# Altium schematic sheet BQ76952_monitor.SchDoc
size A4; SheetNumber: 1; SheetTotal: 2
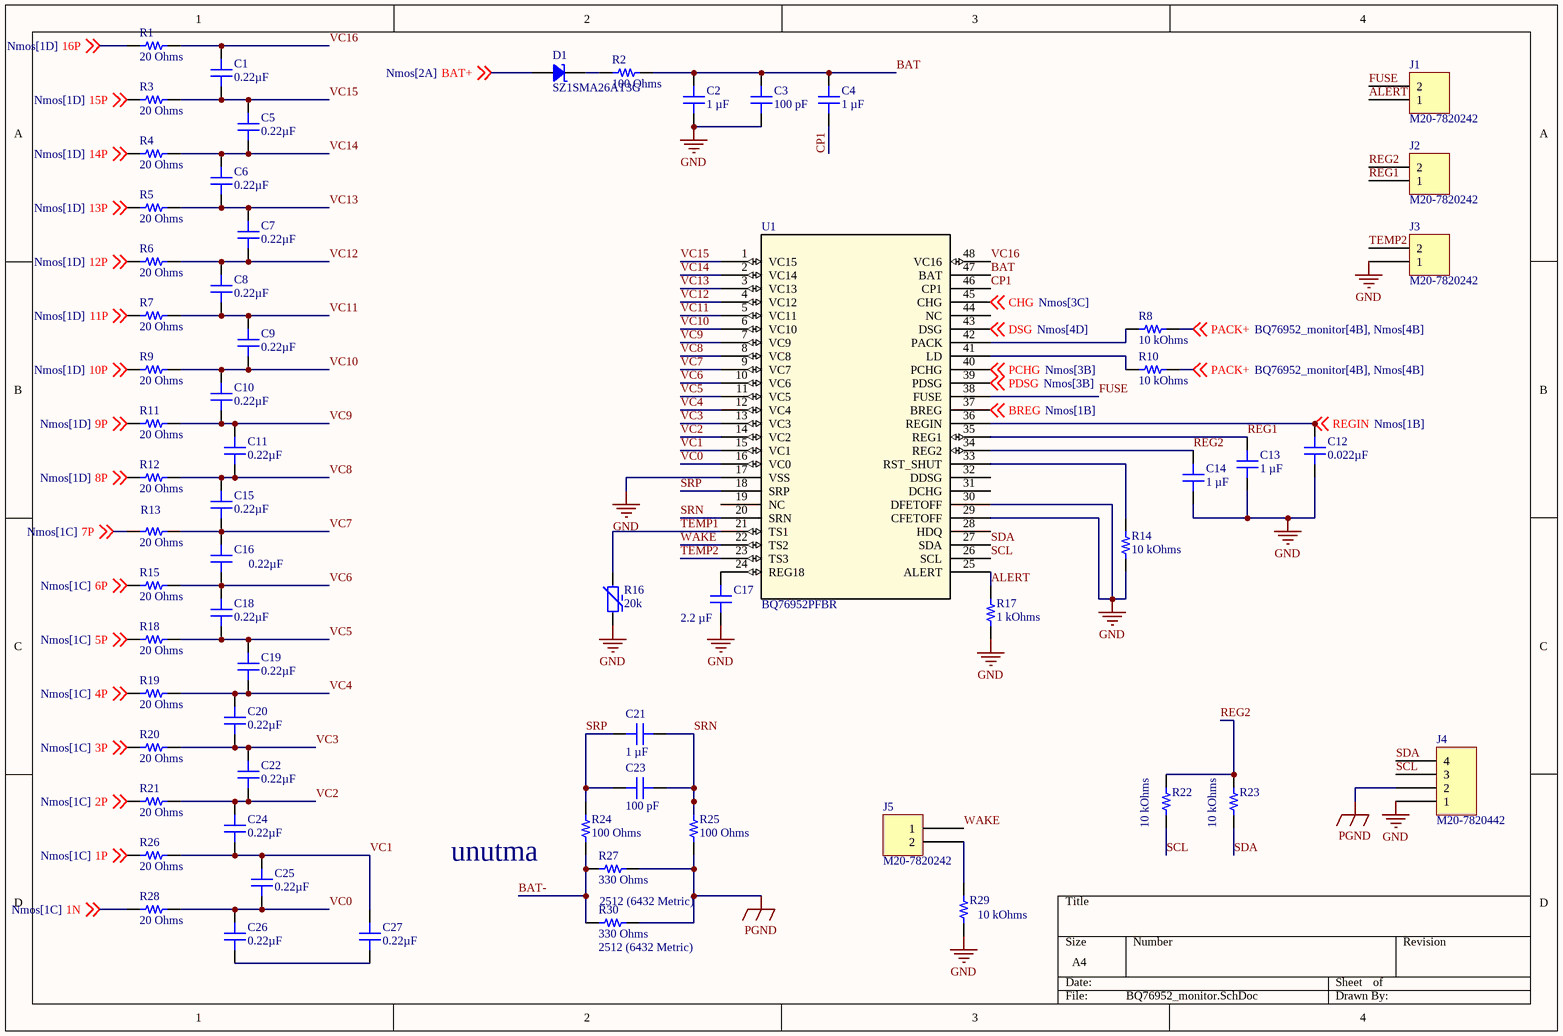
[diagram p0: BQ76952_monitor.SchDoc]

## Parts
C1  0.22µF  [CAP 0805_2012]
C2  1 µF  [CAP 0805_2012]
C3  100 pF  [CAP 0805_2012]
C4  1 µF  [CAP 0805_2012]
C5  0.22µF  [CAP 0805_2012]
C6  0.22µF  [CAP 0805_2012]
C7  0.22µF  [CAP 0805_2012]
C8  0.22µF  [CAP 0805_2012]
C9  0.22µF  [CAP 0805_2012]
C10  0.22µF  [CAP 0805_2012]
C11  0.22µF  [CAP 0805_2012]
C12  0.022µF  [CAP 0805_2012]
C13  1 µF  [CAP 0805_2012]
C14  1 µF  [CAP 0805_2012]
C15  0.22µF  [CAP 0805_2012]
C16  0.22µF  [CAP 0805_2012]
C17  Capacitance: 2.2 µF  [MURATA CAP GRM31M 1206_3216]  (hidden comment: GRM31MR71E225KA93L)
C18  0.22µF  [CAP 0805_2012]
C19  0.22µF  [CAP 0805_2012]
C20  0.22µF  [CAP 0805_2012]
C21  1 µF  [CAP 0805_2012]
C22  0.22µF  [CAP 0805_2012]
C23  100 pF  [CAP 0805_2012]
C24  0.22µF  [CAP 0805_2012]
C25  0.22µF  [CAP 0805_2012]
C26  0.22µF  [CAP 0805_2012]
C27  0.22µF  [CAP 0805_2012]
D1  SZ1SMA26AT3G  [DO214AC SMA]
J1  M20-7820242  [HARWIN M20-7820245]
J2  M20-7820242  [HARWIN M20-7820245]
J3  M20-7820242  [HARWIN M20-7820245]
J4  M20-7820442  [HARWIN M20-7820445]
J5  M20-7820242  [HARWIN M20-7820245]
R1  20 Ohms  [RES 1206_3216]
R2  100 Ohms  [RES 1206_3216]
R3  20 Ohms  [RES 1206_3216]
R4  20 Ohms  [RES 1206_3216]
R5  20 Ohms  [RES 1206_3216]
R6  20 Ohms  [RES 1206_3216]
R7  20 Ohms  [RES 1206_3216]
R8  10 kOhms  [RES 1206_3216]
R9  20 Ohms  [RES 1206_3216]
R10  10 kOhms  [RES 1206_3216]
R11  20 Ohms  [RES 1206_3216]
R12  20 Ohms  [RES 1206_3216]
R13  20 Ohms  [RES 1206_3216]
R14  10 kOhms  [RES 1206_3216]
R15  20 Ohms  [RES 1206_3216]
R16  20k  [NTC 0805_2012]
R17  1 kOhms  [RES 1206_3216]
R18  20 Ohms  [RES 1206_3216]
R19  20 Ohms  [RES 1206_3216]
R20  20 Ohms  [RES 1206_3216]
R21  20 Ohms  [RES 1206_3216]
R22  10 kOhms  [RES 1206_3216]
R23  10 kOhms  [RES 1206_3216]
R24  100 Ohms  [RES 1206_3216]
R25  100 Ohms  [RES 1206_3216]
R26  20 Ohms  [RES 1206_3216]
R27  330 Ohms  Package / Case: 2512 (6432 Metric)  [STACKPOLE CSR2512]
R28  20 Ohms  [RES 1206_3216]
R29  10 kOhms  [RES 1206_3216]
R30  330 Ohms  Package / Case: 2512 (6432 Metric)  [STACKPOLE CSR2512]
U1  BQ76952PFBR  [QFP_2PFBR_TEX]

## Nets
GND: C2.1 C3.1 C12.1 C13.1 C14.1 C17.1 J3.1 J4.1 R14.2 R16.1 R17.1 R29.1 U1.17(VSS) U1.29(CFETOFF) U1.30(DFETOFF)
PGND: J4.2 R25.1 R27.1 R30.1
1N: R28.1 ; off-sheet 1N
1P: R26.1 ; off-sheet 1P
2P: R21.1 ; off-sheet 2P
3P: R20.1 ; off-sheet 3P
4P: R19.1 ; off-sheet 4P
5P: R18.1 ; off-sheet 5P
6P: R15.1 ; off-sheet 6P
7P: R13.1 ; off-sheet 7P
8P: R12.1 ; off-sheet 8P
9P: R11.1 ; off-sheet 9P
10P: R9.1 ; off-sheet 10P
11P: R7.1 ; off-sheet 11P
12P: R6.1 ; off-sheet 12P
13P: R5.1 ; off-sheet 13P
14P: R4.1 ; off-sheet 14P
15P: R3.1 ; off-sheet 15P
16P: R1.1 ; off-sheet 16P
ALERT: J1.1 R17.2 U1.25(ALERT)
BAT: C2.2 C3.2 C4.2 R2.2 U1.47(BAT)
BAT+: D1.1 ; off-sheet BAT+
BAT-: R24.1 R27.2 R30.2
BREG: U1.37(BREG) ; off-sheet BREG
CHG: U1.45(CHG) ; off-sheet CHG
CP1: C4.1 U1.46(CP1)
DSG: U1.43(DSG) ; off-sheet DSG
FUSE: J1.2 U1.38(FUSE)
PACK+: R8.1 R10.1 ; off-sheet PACK+
PCHG: U1.40(PCHG) ; off-sheet PCHG
PDSG: U1.39(PDSG) ; off-sheet PDSG
REG1: C13.2 J2.1 U1.35(REG1)
REG2: C14.2 J2.2 R22.2 R23.2 U1.34(REG2)
REGIN: C12.2 U1.36(REGIN) ; off-sheet REGIN
SCL: J4.3 R22.1 U1.26(SCL)
SDA: J4.4 R23.1 U1.27(SDA)
SRN: C21.1 C23.1 R25.2 U1.20(SRN)
SRP: C21.2 C23.2 R24.2 U1.18(SRP)
TEMP1: R16.2 U1.21(TS1)
TEMP2: J3.2 U1.23(TS3)
VC0: C25.1 C26.2 R28.2 U1.16(VC0)
VC1: C24.1 C25.2 C27.2 R26.2 U1.15(VC1)
VC2: C22.1 C24.2 R21.2 U1.14(VC2)
VC3: C20.1 C22.2 R20.2 U1.13(VC3)
VC4: C19.1 C20.2 R19.2 U1.12(VC4)
VC5: C18.1 C19.2 R18.2 U1.11(VC5)
VC6: C16.1 C18.2 R15.2 U1.10(VC6)
VC7: C15.1 C16.2 R13.2 U1.9(VC7)
VC8: C11.1 C15.2 R12.2 U1.8(VC8)
VC9: C10.1 C11.2 R11.2 U1.7(VC9)
VC10: C9.1 C10.2 R9.2 U1.6(VC10)
VC11: C8.1 C9.2 R7.2 U1.5(VC11)
VC12: C7.1 C8.2 R6.2 U1.4(VC12)
VC13: C6.1 C7.2 R5.2 U1.3(VC13)
VC14: C5.1 C6.2 R4.2 U1.2(VC14)
VC15: C1.1 C5.2 R3.2 U1.1(VC15)
VC16: C1.2 R1.2 U1.48(VC16)
WAKE: J5.1 U1.22(TS2)
NetC17_2: C17.2 U1.24(REG18)
NetC26_1: C26.1 C27.1
NetD1_2: D1.2 R2.1
NetJ5_2: J5.2 R29.2
NetR8_2: R8.2 U1.42(PACK)
NetR10_2: R10.2 U1.41(LD)
NetR14_1: R14.1 U1.33(RST_SHUT)

Not connected (* = marked no-connect by the designer): U1 19(NC) 28(HDQ) 31(DCHG) 32(DDSG) 44(NC)

## Notes on the sheet
- unutma

## Library data of the parts
C1 C5-C11 C15 C16 C18-C20 C22 C24-C27 = 0805YC224KAT2A: CAP CER 0.22UF 16V X7R 0805; manufacturer: AVX Corporation; Tolerance: ±10%; Part Number: 0805YC224KAT2A; Capacitance: 0.22µF; Applications: General Purpose; componentlink1description: Datasheet; componentlink1url: http://datasheets.avx.com/X7RDielectric.pdf; componentlink2description: DigiKey Link; componentlink2url: http://digikey.com/product-detail/en/avx-corporation/0805YC224KAT2A/478-1400-1-ND/564432; Device Package: 0805 (2012 Metric); lastupdated: 2.09.2020 01:04:22; Lifecycle Status: Active; Minimum Order: 1; Mounting Type: Surface Mount, MLCC; Operating Temperature: -55°C ~ 125°C; Package / Case: 0805 (2012 Metric); packaging: TapeAndReel; partid: 13081; Part Status: Active; price: 0.05; series: -; Size / Dimension: 0.079" L x 0.049" W (2.01mm x 1.25mm); Supplier 1: DigiKey; Supplier Part Number 1: 478-1400-1-ND; Temperature Coefficient: X7R; Thickness (Max): 0.037" (0.94mm); value: 0.22µF; Voltage - Rated: 16V
C2 C4 C21 = HMR212CC7105KG-T: CAP MLCC 1UF 10% 100V X7S 0805; manufacturer: Taiyo Yuden; Part Number: HMR212CC7105KG-T; Capacitance: 1 µF; Applications: Automotive, Bypass, Decoupling; componentlink1description: Datasheet; componentlink1url: https://ds.yuden.co.jp/TYCOMPAS/ut/detail?pn=HMR212CC7105KG-T&u=M; componentlink2description: DigiKey Link; componentlink2url: https://www.digikey.com/en/products/detail/taiyo-yuden/HMR212CC7105KG-T/13414962; Device Package: 0805 (2012 Metric); lastupdated: 9.02.2024 20:14:59; Lifecycle Status: Active; Minimum Order: 1; Mounting Type: Surface Mount, MLCC; Operating Temperature: -55°C ~ 125°C; Package / Case: 0805 (2012 Metric); packaging: TapeAndReel; partid: 42417; Part Status: Active; price: 0.08; Ratings: AEC-Q200; series: M; Size / Dimension: 0.079" L x 0.049" W (2.00mm x 1.25mm); Supplier 1: DigiKey; Supplier Part Number 1: 587-HMR212CC7105KG-TCT-ND; Temperature Coefficient: X7S; Thickness (Max): 0.059" (1.50mm); Tolerance: ±10%; value: 1 µF; Voltage - Rated: 100V
C3 C23 = CL21C101JC61PNC: CAP CER 100PF 100V C0G/NP0 0805; manufacturer: Samsung Electro-Mechanics; Temperature Coefficient: C0G, NP0; Tolerance: ±5%; Part Number: CL21C101JC61PNC; Capacitance: 100 pF; Applications: Automotive; componentlink1description: Datasheet; componentlink1url: http://www.samsungsem.com/kr/support/product-search/mlcc/CL21C101JC61PNC.jsp; componentlink2description: DigiKey Link; componentlink2url: https://www.digikey.com/en/products/detail/samsung-electro-mechanics/CL21C101JC61PNC/3888227; Device Package: 0805 (2012 Metric); lastupdated: 9.02.2024 20:15:36; Lifecycle Status: Active; Minimum Order: 1; Mounting Type: Surface Mount, MLCC; Operating Temperature: -55°C ~ 125°C; Package / Case: 0805 (2012 Metric); packaging: TapeAndReel; partid: 14416; Part Status: Active; price: 0.01; Ratings: AEC-Q200; series: CL; Size / Dimension: 0.079" L x 0.049" W (2.00mm x 1.25mm); Supplier 1: DigiKey; Supplier Part Number 1: 1276-2569-1-ND; Thickness (Max): 0.028" (0.70mm); value: 100 pF; Voltage - Rated: 100V
C12 = 08051C223K4T2A: CAP CER 0.022UF 100V X7R 0805; manufacturer: AVX Corporation; Tolerance: ±10%; Part Number: 08051C223K4T2A; Capacitance: 0.022µF; Applications: Automotive; componentlink1description: Datasheet; componentlink1url: http://datasheets.avx.com/AutoMLCC.pdf; componentlink2description: DigiKey Link; componentlink2url: http://digikey.com/product-detail/en/avx-corporation/08051C223K4T2A/478-9378-1-ND/4901452; Device Package: 0805 (2012 Metric); lastupdated: 2.09.2020 01:04:32; Lifecycle Status: Active; Minimum Order: 1; Mounting Type: Surface Mount, MLCC; Operating Temperature: -55°C ~ 125°C; Package / Case: 0805 (2012 Metric); packaging: TapeAndReel; partid: 7798; Part Status: Active; price: 0.03; Ratings: AEC-Q200; series: -; Size / Dimension: 0.079" L x 0.049" W (2.00mm x 1.25mm); Supplier 1: DigiKey; Supplier Part Number 1: 478-9378-1-ND; Temperature Coefficient: X7R; Thickness (Max): 0.050" (1.27mm); value: 0.022µF; Voltage - Rated: 100V
C13 C14 = C0805C105M4VAC7800: CAP CER 1UF 16V Y5V 0805; manufacturer: KEMET; Temperature Coefficient: Y5V (F); Tolerance: ±20%; Part Number: C0805C105M4VAC7800; Capacitance: 1 µF; Applications: General Purpose; componentlink1description: Datasheet; componentlink1url: https://connect.kemet.com:7667/gateway/IntelliData-ComponentDocumentation/1.0/download/datasheet/C0805C105M4VACTU; componentlink2description: DigiKey Link; componentlink2url: https://www.digikey.com/en/products/detail/kemet/C0805C105M4VAC7800/2211778; Device Package: 0805 (2012 Metric); lastupdated: 9.02.2024 20:15:00; Lifecycle Status: Active; Minimum Order: 1; Mounting Type: Surface Mount, MLCC; Operating Temperature: -30°C ~ 85°C; Package / Case: 0805 (2012 Metric); packaging: TapeAndReel; partid: 42473; Part Status: Active; price: 0.02; series: SMD Comm Y5V; Size / Dimension: 0.079" L x 0.049" W (2.00mm x 1.25mm); Supplier 1: DigiKey; Supplier Part Number 1: 399-C0805C105M4VAC7800CT-ND; Thickness (Max): 0.039" (1.00mm); value: 1 µF; Voltage - Rated: 16V
C17 = GRM31MR71E225KA93L: CAP CER 2.2UF 25V X7R 1206; manufacturer: Murata Electronics; Tolerance: ±10%; Part Number: GRM31MR71E225KA93L; Applications: General Purpose; componentlink1description: Datasheet; componentlink1url: https://www.murata.com/~/media/webrenewal/support/library/catalog/products/capacitor/mlcc/c02e.ashx?la=en-us; componentlink2description: DigiKey Link; componentlink2url: https://www.digikey.com/en/products/detail/murata-electronics/GRM31MR71E225KA93L/702632; Device Package: 1206 (3216 Metric); lastupdated: 25.07.2024 10:41:16; Lifecycle Status: Active; Minimum Order: 1; Mounting Type: Surface Mount, MLCC; Operating Temperature: -55°C ~ 125°C; Package / Case: 1206 (3216 Metric); packaging: TapeAndReel; partid: 57330; Part Status: Not For New Designs; price: 0.06; series: GRM; Size / Dimension: 0.126" L x 0.063" W (3.20mm x 1.60mm); Supplier 1: DigiKey; Supplier Part Number 1: 490-3368-1-ND; Temperature Coefficient: X7R; Thickness (Max): 0.049" (1.25mm); Voltage - Rated: 25V
D1 = SZ1SMA26AT3G: TVS DIODE 26VWM 42.1VC SMA; Manufacturer: Littelfuse Inc.; Capacitance @ Frequency: 460pF @ 1MHz; Current - Peak Pulse (10/1000µs): 9.5A; Power Line Protection: No; Power - Peak Pulse: 400W; Type: Zener; Unidirectional Channels: 1; Voltage - Breakdown (Min): 28.9V; Voltage - Clamping (Max) @ Ipp: 42.1V; Voltage - Reverse Standoff (Typ): 26V; Part Number: SZ1SMA26AT3G; Applications: Automotive; ComponentLink1Description: Datasheet; ComponentLink1URL: https://www.littelfuse.com/~/media/electronics/datasheets/tvs_diodes/littelfuse_tvs_diode_sz1smaxxa_datasheet.pdf.pdf; ComponentLink2Description: DigiKey Link; ComponentLink2URL: https://www.digikey.com/en/products/detail/littelfuse-inc/SZ1SMA26AT3G/3062915; LastUpdated: 3.06.2024 19:57:20; Lifecycle Status: Active; Minimum Order: 1; Mounting Type: Surface Mount; Operating Temperature: -65°C ~ 150°C (TJ); Package / Case: DO-214AC, SMA; Packaging: TapeAndReel; PartId: 5569; Part Status: Active; Price: 0.16; Series: SZ1SMA; Supplier 1: DigiKey; Supplier Part Number 1: F11514CT-ND; Supplier Device Package: SMA
J1-J3 J5 = M20-7820242: CONN RCPT 2POS 0.1 GOLD PCB; Manufacturer: Harwin Inc.; Connector Type: Receptacle; Contact Length - Post: 0.118" (3.00mm); Current Rating (Amps): 3A; Mated Stacking Heights: 11.04mm, 12.63mm; Material Flammability Rating: UL94 V-0; Number of Positions: 2; Number of Positions Loaded: All; Pitch - Mating: 0.100" (2.54mm); Style: Board to Board or Cable; Part Number: M20-7820242; ComponentLink1Description: Datasheet; ComponentLink1URL: https://cdn.harwin.com/pdfs/C001XX_M20_Series_Connectors.pdf; ComponentLink2Description: DigiKey Link; ComponentLink2URL: https://www.digikey.com/en/products/detail/harwin-inc/M20-7820242/3727744; Contact Finish - Mating: Gold; Contact Finish - Post: Tin; Contact Finish Thickness - Mating: Flash; Contact Type: Female Socket; Fastening Type: Push-Pull; Insulation Color: Black; Insulation Height: 0.335" (8.51mm); LastUpdated: 21.09.2022 18:53:47; Lifecycle Status: Active; Minimum Order: 1; Mounting Type: Through Hole; Number of Rows: 1; Operating Temperature: -40°C ~ 105°C; Packaging: Tube; Part Status: Active; Price: 0.38; Series: M20; Supplier 1: DigiKey; Supplier Part Number 1: 952-1775-ND; Termination: Solder
J4 = M20-7820442: CONN RCPT 4POS 0.1 GOLD PCB; Manufacturer: Harwin Inc.; Connector Type: Receptacle; Contact Length - Post: 0.118" (3.00mm); Current Rating (Amps): 3A; Mated Stacking Heights: 11.04mm, 12.63mm; Material Flammability Rating: UL94 V-0; Number of Positions: 4; Number of Positions Loaded: All; Pitch - Mating: 0.100" (2.54mm); Style: Board to Board or Cable; Part Number: M20-7820442; ComponentLink1Description: Datasheet; ComponentLink1URL: https://cdn.harwin.com/pdfs/Harwin_PC_Connectors_M20.pdf; ComponentLink2Description: DigiKey Link; ComponentLink2URL: https://www.digikey.com/en/products/detail/harwin-inc/M20-7820442/3727760; Contact Finish - Mating: Gold; Contact Finish - Post: Tin; Contact Finish Thickness - Mating: Flash; Contact Type: Female Socket; Fastening Type: Push-Pull; Insulation Color: Black; Insulation Height: 0.335" (8.51mm); LastUpdated: 21.09.2022 18:57:11; Lifecycle Status: Active; Minimum Order: 1; Mounting Type: Through Hole; Number of Rows: 1; Operating Temperature: -40°C ~ 105°C; Packaging: Tube; Part Status: Active; Price: 0.45; Series: M20; Supplier 1: DigiKey; Supplier Part Number 1: 952-1791-ND; Termination: Solder
R1 R3-R7 R9 R11-R13 R15 R18-R21 R26 R28 = ESR18EZPF20R0: RES SMD 20 OHM 1% 1/2W 1206; Manufacturer: Rohm Semiconductor; Power (Watts): 0.5W, 1/2W; Temperature Coefficient: ±100ppm/°C; Part Number: ESR18EZPF20R0; ComponentLink1Description: Datasheet; ComponentLink1URL: https://www.rohm.com/datasheet/ESR01MZPF/esr-e; ComponentLink2Description: DigiKey Link; ComponentLink2URL: https://www.digikey.com/en/products/detail/rohm-semiconductor/ESR18EZPF20R0/1983601; Composition: Thick Film; Device Package: 1206 (3216 Metric); Features: Automotive AEC-Q200, Pulse Withstanding; Height - Seated (Max): 0.026" (0.65mm); LastUpdated: 9.02.2024 20:54:45; Lifecycle Status: Active; Minimum Order: 1; Number of Terminations: 2; Operating Temperature: -55°C ~ 155°C; Package / Case: 1206 (3216 Metric); Packaging: TapeAndReel; PartId: 26961; Part Status: Active; Price: 0.02; Ratings: AEC-Q200; Resistance: 20 Ohms; Series: ESR; Size / Dimension: 0.126" L x 0.063" W (3.20mm x 1.60mm); Supplier 1: DigiKey; Supplier Part Number 1: RHM20.0AFCT-ND; Supplier Device Package: 1206; Tolerance: ±1%; Value: 20 Ohms
R2 R24 R25 = RNCS1206BKE100R: RES 100 OHM 0.1% 1/8W 1206; Manufacturer: Stackpole Electronics Inc; Power (Watts): 0.125W, 1/8W; Temperature Coefficient: ±25ppm/°C; Part Number: RNCS1206BKE100R; ComponentLink1Description: Datasheet; ComponentLink1URL: https://www.seielect.com/catalog/sei-rncs_rnch.pdf; ComponentLink2Description: DigiKey Link; ComponentLink2URL: https://www.digikey.com/en/products/detail/stackpole-electronics-inc/RNCS1206BKE100R/1800111; Composition: Thin Film; Device Package: 1206 (3216 Metric); Features: Anti-Corrosive, Automotive AEC-Q200, Moisture Resistant; Height - Seated (Max): 0.026" (0.65mm); LastUpdated: 9.02.2024 20:54:46; Lifecycle Status: Active; Minimum Order: 1; Number of Terminations: 2; Operating Temperature: -55°C ~ 155°C; Package / Case: 1206 (3216 Metric); Packaging: TapeAndReel; PartId: 26857; Part Status: Active; Price: 0.08; Ratings: AEC-Q200; Resistance: 100 Ohms; Series: RNCS; Size / Dimension: 0.120" L x 0.061" W (3.05mm x 1.55mm); Supplier 1: DigiKey; Supplier Part Number 1: RNCS1206BKE100RCT-ND; Supplier Device Package: 1206; Tolerance: ±0.1%; Value: 100 Ohms
R8 R10 R14 R22 R23 R29 = ERA-8ARB103V: RES SMD 10K OHM 0.1% 1/4W 1206; Manufacturer: Panasonic Electronic Components; Power (Watts): 0.25W, 1/4W; Temperature Coefficient: ±10ppm/°C; Part Number: ERA-8ARB103V; ComponentLink1Description: Datasheet; ComponentLink1URL: https://industrial.panasonic.com/cdbs/www-data/pdf/RDM0000/AOA0000C307.pdf; ComponentLink2Description: DigiKey Link; ComponentLink2URL: https://www.digikey.com/en/products/detail/panasonic-electronic-components/ERA-8ARB103V/5141086; Composition: Thin Film; Device Package: 1206 (3216 Metric); Features: Automotive AEC-Q200; Height - Seated (Max): 0.028" (0.70mm); LastUpdated: 9.02.2024 20:54:29; Lifecycle Status: Active; Minimum Order: 1; Number of Terminations: 2; Operating Temperature: -55°C ~ 155°C; Package / Case: 1206 (3216 Metric); Packaging: TapeAndReel; PartId: 30804; Part Status: Active; Price: 0.37; Ratings: AEC-Q200; Resistance: 10 kOhms; Series: ERA-8A; Size / Dimension: 0.126" L x 0.063" W (3.20mm x 1.60mm); Supplier 1: DigiKey; Supplier Part Number 1: P10KCSCT-ND; Supplier Device Package: 1206; Tolerance: ±0.1%; Value: 10 kOhms
R16 = NHQM203B400T5: THERMISTOR NTC 20KOHM 4000K 0805; Manufacturer: Amphenol Advanced Sensors; B Value Tolerance: ±5%; Part Number: NHQM203B400T5; B25/85: 4000K; ComponentLink1Description: Datasheet; ComponentLink1URL: https://www.amphenol-sensors.com/index.php?option=com_edocman&task=document.download&id=82; ComponentLink2Description: DigiKey Link; ComponentLink2URL: http://digikey.com/product-detail/en/amphenol-advanced-sensors/NHQM203B400T5/NHQM203B400T5-ND/1772828; LastUpdated: 30.08.2020 21:02:56; Lifecycle Status: Active; Minimum Order: 0; Mounting Type: Surface Mount; Package / Case: 0805 (2012 Metric); PartId: 1323; Price: 0; Resistance in Ohms @ 25°C: 20k; Resistance Tolerance: ±5%; Series: NHQ; Supplier 1: DigiKey; Supplier Part Number 1: NHQM203B400T5-ND; Value: 20k
R17 = ERJ-8GEYJ102V: RES SMD 1K OHM 5% 1/4W 1206; Manufacturer: Panasonic Electronic Components; Power (Watts): 0.25W, 1/4W; Temperature Coefficient: ±200ppm/°C; Part Number: ERJ-8GEYJ102V; ComponentLink1Description: Datasheet; ComponentLink1URL: http://industrial.panasonic.com/www-cgi/jvcr13pz.cgi?E+PZ+3+AOA0001+ERJ8GEYJ102V+7+WW; ComponentLink2Description: DigiKey Link; ComponentLink2URL: https://www.digikey.com/en/products/detail/panasonic-electronic-components/ERJ-8GEYJ102V/10364; Composition: Thick Film; Device Package: 1206 (3216 Metric); Features: Automotive AEC-Q200; Height - Seated (Max): 0.028" (0.70mm); LastUpdated: 9.02.2024 20:54:45; Lifecycle Status: Active; Minimum Order: 1; Number of Terminations: 2; Operating Temperature: -55°C ~ 155°C; Package / Case: 1206 (3216 Metric); Packaging: TapeAndReel; PartId: 26983; Part Status: Active; Price: 0.02; Ratings: AEC-Q200; Resistance: 1 kOhms; Series: ERJ-8G; Size / Dimension: 0.126" L x 0.063" W (3.20mm x 1.60mm); Supplier 1: DigiKey; Supplier Part Number 1: P1.0KECT-ND; Supplier Device Package: 1206; Tolerance: ±5%; Value: 1 kOhms
R27 R30 = CRM2512-FX-3300ELF: RES SMD 330 OHM 1% 2W 2512; Manufacturer: Bourns Inc.; Temperature Coefficient: ±100ppm/°C; Part Number: CRM2512-FX-3300ELF; ComponentLink1Description: Datasheet; ComponentLink1URL: https://www.bourns.com/docs/Product-Datasheets/CRM.pdf; ComponentLink2Description: DigiKey Link; ComponentLink2URL: https://www.digikey.com/en/products/detail/bourns-inc/CRM2512-FX-3300ELF/4698386; Composition: Thick Film; Device Package: 2512 (6432 Metric); Features: Current Sense; Height - Seated (Max): 0.031" (0.80mm); LastUpdated: 17.02.2022 18:43:58; Lifecycle Status: Active; Minimum Order: 1; Number of Terminations: 2; Operating Temperature: -55°C ~ 155°C; Packaging: TapeAndReel; PartId: 1636; Part Status: Active; Power (Watts): 2W; Price: 0.12; Resistance: 330 Ohms; Series: CRM2512; Size / Dimension: 0.248" L x 0.122" W (6.30mm x 3.10mm); Supplier 1: DigiKey; Supplier Part Number 1: CRM2512-FX-3300ELFCT-ND; Supplier Device Package: 2512; Tolerance: ±1%; Value: 330 Ohms
U1 = BQ76952PFBR: No Description Available; Mfr_Name: Texas Instruments; RefDes: RefDes; Type: Type